# EAGLE design Ctrl_main10 (EAGLE 9.1.3)
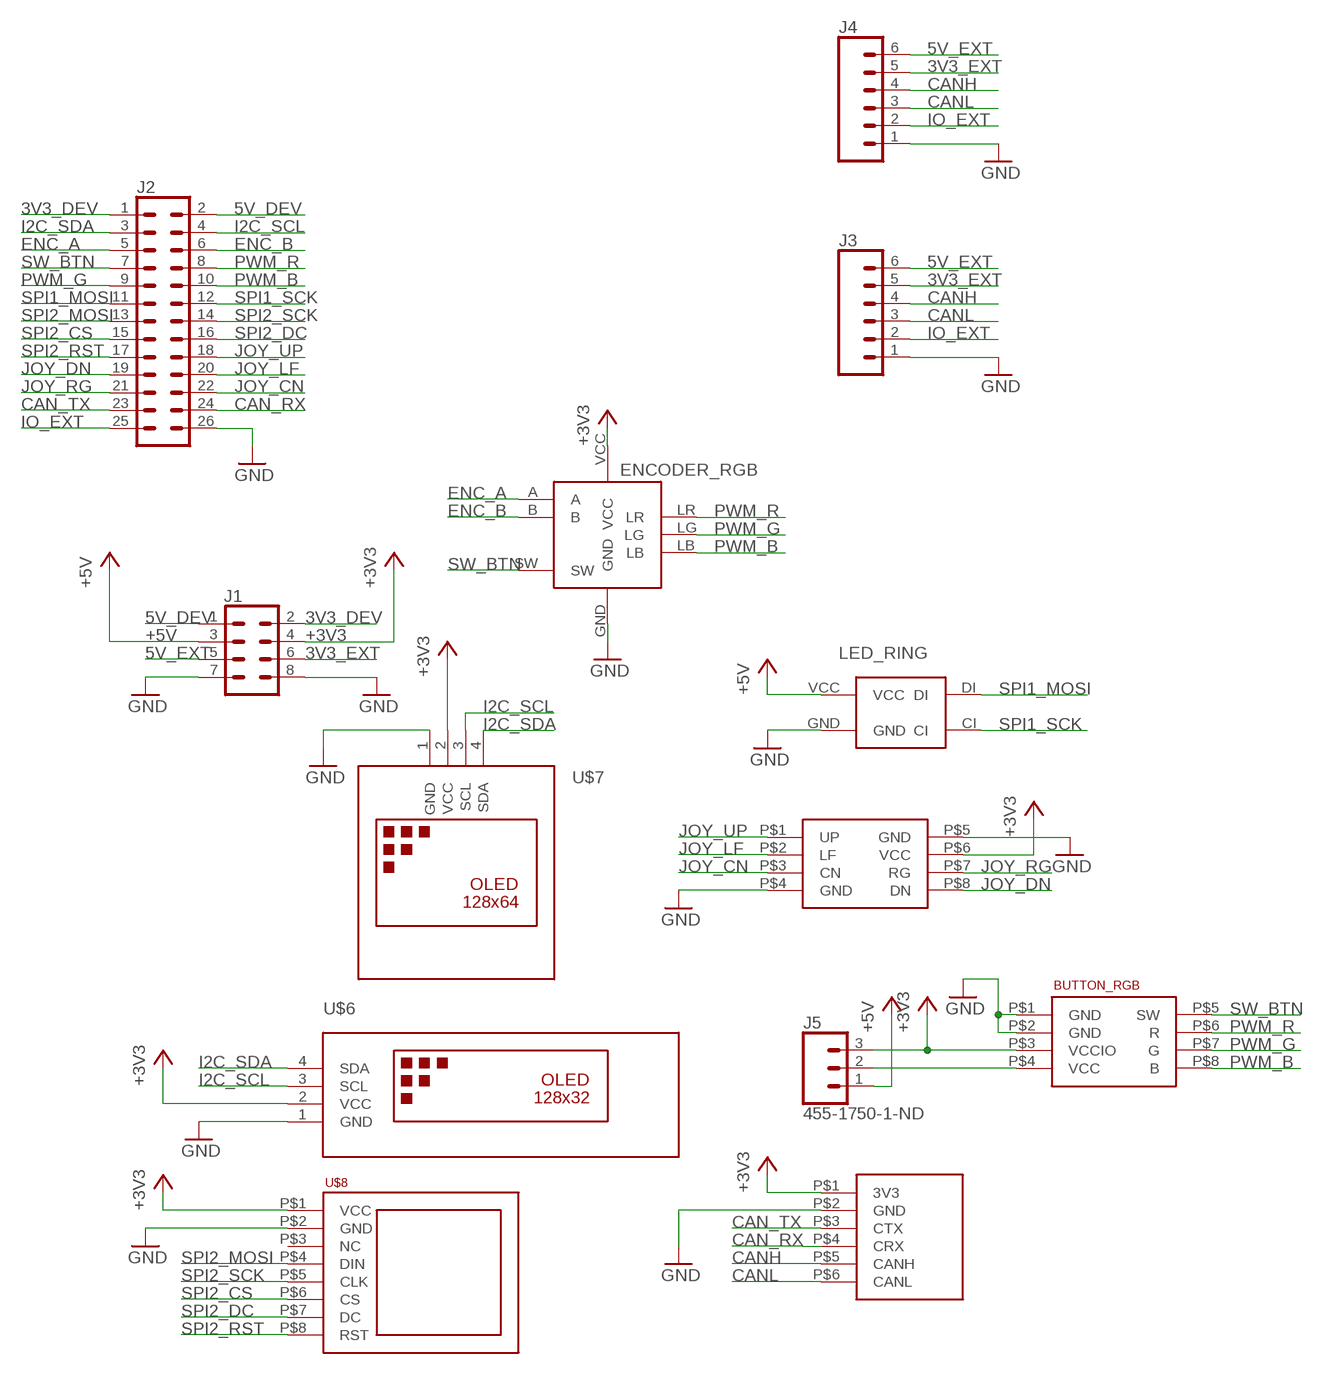
[diagram p0: schematic, sheet 1]

## Parts
BUTTON_RGB  CTRL_BTNRGB_BRD  [CTRL_BTNRGB_BRD]
ENCODER_RGB  CTRL_ENC  [CTRL_ENC]
J1  CONN_04X2  [2X4]
J2  CONN_13X22X13  [2X13]
J3  CONN_06SILK_FEMALE_PTH  [1X06]
J4  CONN_06SILK_FEMALE_PTH  [1X06]
J5  455-1750-1-ND  CONN_03  [1X03]
LED_RING  CTRL_RING  [CTRL_RING]
U$3  CTRL_JOY  [CTRL_JOY]
U$4  CTRL_CAN  [CTRL_CAN]
U$6  DISPLAY-OLED-128X32  [DISPLAY-OLED-128X32]
U$7  DISPLAY-OLED-128X64-I2C  [DISPLAY-OLED-128X64-I2C]
U$8  OLED_WS128  [OLED_WS128]

## Nets
3V3_DEV: J1.2 J2.1
3V3_EXT: J1.6 J3.5 J4.5
5V_DEV: J1.1 J2.2
5V_EXT: J1.5 J3.6 J4.6
+3V3: BUTTON_RGB.P$3(VCCIO) ENCODER_RGB.VCC J1.4 J5.3 U$3.P$6(VCC) U$4.P$1(3V3) U$6.2(VCC) U$7.2(VCC) U$8.P$1(VCC)
+5V: J1.3 J5.1 LED_RING.VCC
CAN_RX: J2.24 U$4.P$4(CRX)
CAN_TX: J2.23 U$4.P$3(CTX)
CANH: J3.4 J4.4 U$4.P$5(CANH)
CANL: J3.3 J4.3 U$4.P$6(CANL)
ENC_A: ENCODER_RGB.A J2.5
ENC_B: ENCODER_RGB.B J2.6
GND: BUTTON_RGB.P$1(GND) BUTTON_RGB.P$2(GND) ENCODER_RGB.GND J1.7 J1.8 J2.26 J3.1 J4.1 LED_RING.GND U$3.P$4(GND) U$3.P$5(GND) U$4.P$2(GND) U$6.1(GND) U$7.1(GND) U$8.P$2(GND)
I2C_SCL: J2.4 U$6.3(SCL) U$7.3(SCL)
I2C_SDA: J2.3 U$6.4(SDA) U$7.4(SDA)
IO_EXT: J2.25 J3.2 J4.2
JOY_CN: J2.22 U$3.P$3(CN)
JOY_DN: J2.19 U$3.P$8(DN)
JOY_LF: J2.20 U$3.P$2(LF)
JOY_RG: J2.21 U$3.P$7(RG)
JOY_UP: J2.18 U$3.P$1(UP)
N$1: BUTTON_RGB.P$4(VCC) J5.2
PWM_B: BUTTON_RGB.P$8(B) ENCODER_RGB.LB J2.10
PWM_G: BUTTON_RGB.P$7(G) ENCODER_RGB.LG J2.9
PWM_R: BUTTON_RGB.P$6(R) ENCODER_RGB.LR J2.8
SPI1_MOSI: J2.11 LED_RING.DI
SPI1_SCK: J2.12 LED_RING.CI
SPI2_CS: J2.15 U$8.P$6(CS)
SPI2_DC: J2.16 U$8.P$7(DC)
SPI2_MOSI: J2.13 U$8.P$4(DIN)
SPI2_RST: J2.17 U$8.P$8(RST)
SPI2_SCK: J2.14 U$8.P$5(CLK)
SW_BTN: BUTTON_RGB.P$5(SW) ENCODER_RGB.SW J2.7
Unconnected: U$8.P$3(NC)

## Library data of the parts
BUTTON_RGB = Ctrl:CTRL_BTNRGB_BRD
ENCODER_RGB = Ctrl:CTRL_ENC
J1 = SparkFun-Connectors:CONN_04X2: Multi connection point. Often used as Generic Header-pin footprint for 0.1 inch spaced/style header connections On any of the 0.1 inch spaced packages, you can populate with these: Break Away Headers - Straight <https://www.sparkfun.com/products/116> (PRT-00116) Break Away Male Headers - Right Angle <https://www.sparkfun.com/products/553> (PRT-00553) Female Headers <https://www.sparkfun.com/products/115> (PRT-00115) Break Away Headers - Machine Pin <https://www.sparkfun.com/products/117> (PRT-00117) Break Away Female Headers - Swiss Machine Pin <https://www.sparkfun.com/products/743> (PRT-00743)
J2 = Ctrl:CONN_13X2: Multi connection point. Often used as Generic Header-pin footprint for 0.1 inch spaced/style header connections On any of the 0.1 inch spaced packages, you can populate with these: Break Away Headers - Straight <https://www.sparkfun.com/products/116> (PRT-00116) Break Away Male Headers - Right Angle <https://www.sparkfun.com/products/553> (PRT-00553) Female Headers <https://www.sparkfun.com/products/115> (PRT-00115) Break Away Headers - Machine Pin <https://www.sparkfun.com/products/117> (PRT-00117) Break Away Female Headers - Swiss Machine Pin <https://www.sparkfun.com/products/743> (PRT-00743)
J3 J4 = SparkFun-Connectors:CONN_06: Multi connection point. Often used as Generic Header-pin footprint for 0.1 inch spaced/style header connections On any of the 0.1 inch spaced packages, you can populate with these: Break Away Headers - Straight <https://www.sparkfun.com/products/116> (PRT-00116) Break Away Male Headers - Right Angle <https://www.sparkfun.com/products/553> (PRT-00553) Female Headers <https://www.sparkfun.com/products/115> (PRT-00115) Break Away Headers - Machine Pin <https://www.sparkfun.com/products/117> (PRT-00117) Break Away Female Headers - Swiss Machine Pin <https://www.sparkfun.com/products/743> (PRT-00743) Arduino Stackable Header - 6 Pin <https://www.sparkfun.com/products/9280> (PRT-09280) For SCREWTERMINALS and SPRING TERMINALS visit here: Screw Terimnals on SparkFun.com <https://www.sparkfun.com/search/results?term=Screw+Terminals> (5mm/3.5mm/2.54mm spacing) This device is also useful as a general connection point to wire up your design to another part of your project. Our various solder wires solder well into these plated through hole pads. Hook-Up Wire - Assortment (Stranded, 22 AWG) <https://www.sparkfun.com/products/11375> (PRT-11375) Hook-Up Wire - Assortment (Solid Core, 22 AWG) <https://www.sparkfun.com/products/11367> (PRT-11367) View the entire wire category on our website here <https://www.sparkfun.com/categories/141>; PROD_ID: CONN-08437
J5 = SparkFun-Connectors:CONN_03: Multi connection point. Often used as Generic Header-pin footprint for 0.1 inch spaced/style header connections On any of the 0.1 inch spaced packages, you can populate with these: Break Away Headers - Straight <https://www.sparkfun.com/products/116> (PRT-00116) Break Away Male Headers - Right Angle <https://www.sparkfun.com/products/553> (PRT-00553) Female Headers <https://www.sparkfun.com/products/115> (PRT-00115) Break Away Headers - Machine Pin <https://www.sparkfun.com/products/117> (PRT-00117) Break Away Female Headers - Swiss Machine Pin <https://www.sparkfun.com/products/743> (PRT-00743) Stackable Header - 3 Pin (Female, 0.1") <https://www.sparkfun.com/products/13875> (PRT-13875) For SCREWTERMINALS and SPRING TERMINALS visit here: Screw Terimnals on SparkFun.com <https://www.sparkfun.com/search/results?term=Screw+Terminals> (5mm/3.5mm/2.54mm spacing) This device is also useful as a general connection point to wire up your design to another part of your project. Our various solder wires solder well into these plated through hole pads. Hook-Up Wire - Assortment (Stranded, 22 AWG) <https://www.sparkfun.com/products/11375> (PRT-11375) Hook-Up Wire - Assortment (Solid Core, 22 AWG) <https://www.sparkfun.com/products/11367> (PRT-11367) View the entire wire category on our website here <https://www.sparkfun.com/categories/141> Special notes: Molex polarized connector foot print use with SKU : PRT-08232 with associated crimp pins and housings.; PROD_ID: XXX-00000
LED_RING = Ctrl:CTRL_RING
U$3 = Ctrl:CTRL_JOY
U$4 = Ctrl:CTRL_CAN
U$6 = diy-modules:DISPLAY-OLED-128X32: 128x32 Dot Matrix OLED Module with I2C interface based on SSD1306 chip More details available here: http://www.tinyosshop.com/index.php?route=product/product&product_id=953 Schematic available here: http://www.tinyosshop.com/datasheet/OLED%2012832.pdf SSD1306 datasheet: https://cdn-shop.adafruit.com/datasheets/SSD1306.pdf Click here to find device on ebay.com <http://www.ebay.com/sch/oled+display+128x32+i2c>
U$7 = diy-modules:DISPLAY-OLED-128X64-I2C: 128x64 Dot Matrix OLED Module based on SSD1306 chip Variant with I2C interface More details available here: http://www.instructables.com/id/Monochrome-096-i2c-OLED-display-with-arduino-SSD13/ SSD1306 datasheet: https://cdn-shop.adafruit.com/datasheets/SSD1306.pdf Click here to find device on ebay.com <http://www.ebay.com/sch/oled+display+128x64+iic> Note: There are two variants: I2C and SPI. Search for the proper version.
U$8 = Ctrl:OLED_WS128

## Board
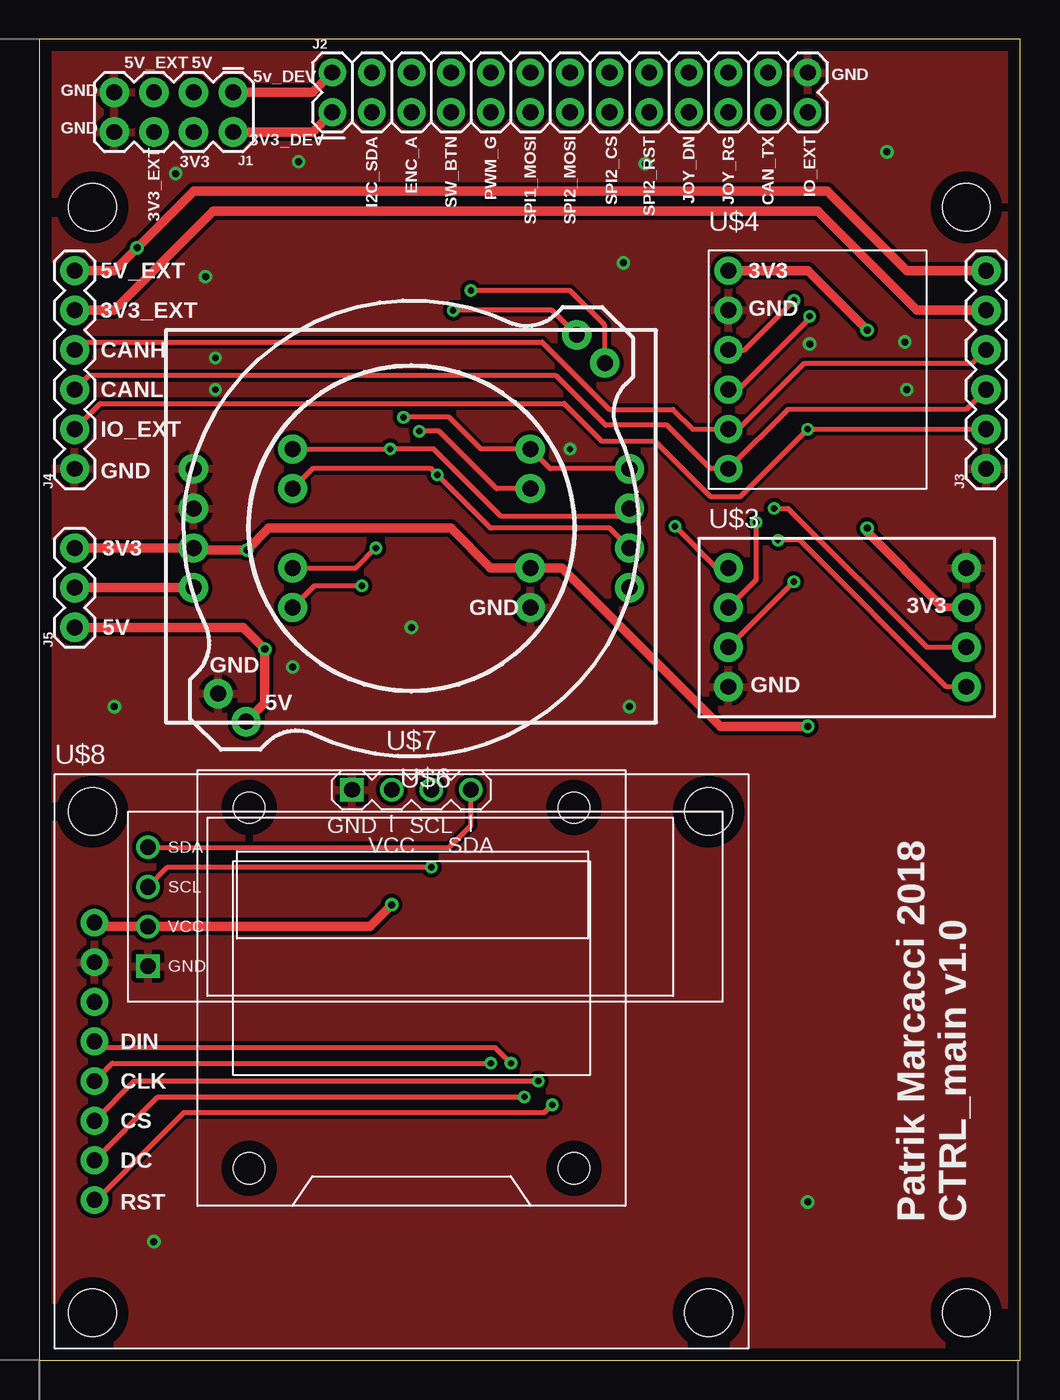
[diagram p1: board, top side]
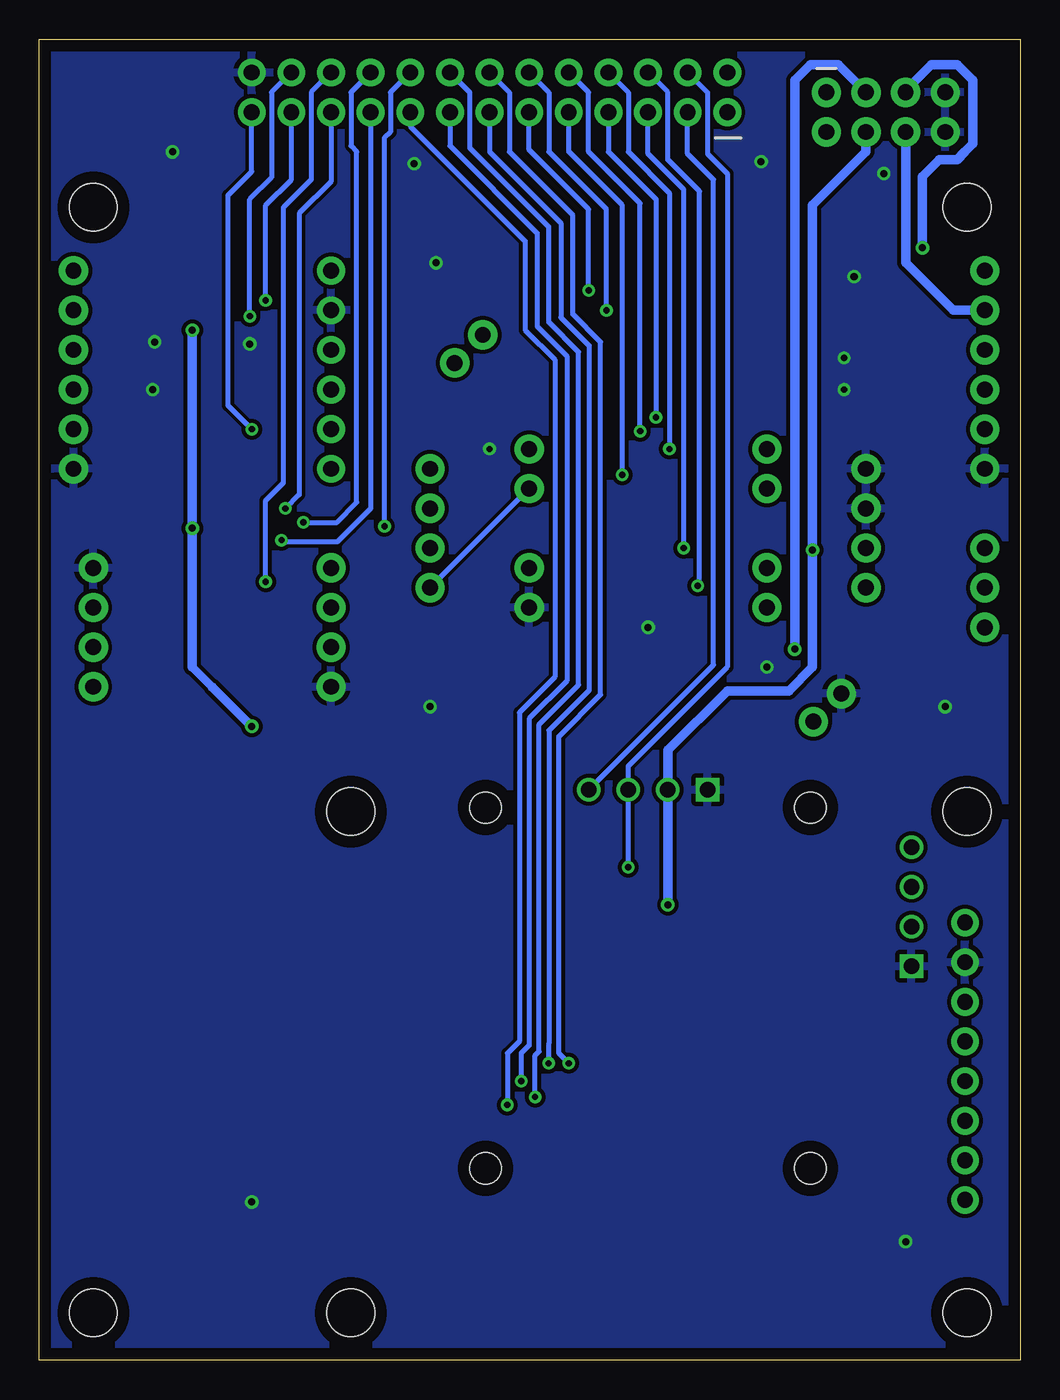
[diagram p2: board, bottom side, seen from below]

Size 62.92 x 84.7 mm. Coordinates in mm from the lower left corner, seen from the top.
Outline: 0,0 62.92,0 62.92,84.7 0,84.7 0,0
Copper layers (1*16): Top 0.035mm / dielectric 1.5mm / Bottom 0.035mm
Design rules "default *": minimum track width 6mil, minimum drill 0.35mm, track to track 10mil, track to pad 10mil, pad to pad 10mil, via to via 10mil, smd to smd 10mil, copper to edge 30mil, drill to drill 6mil, minimum pad ring 10mil, minimum via ring 8mil, stop-mask expansion 4mil, vias tented up to drill 18mil, thermal gap 12mil
Holes 3.05 mm at 59.44,3.05 59.44,73.91 3.43,73.91

### Footprints (pad centres in the part's own frame; a part is rotated, then mirrored left to right if it is on the bottom)
CTRL_BTNRGB_BRD = drill 1.016 pad 1.88: P$1 -13.97,3.81; P$2 -13.97,1.27; P$3 -13.97,-1.27; P$4 -13.97,-3.81; P$5 13.97,3.81; P$6 13.97,1.27; P$7 13.97,-1.27; P$8 13.97,-3.81
CTRL_ENC = drill 1.016 pad 1.88: A -7.62,-2.54; B -7.62,-5.08; GND 7.62,-5.08; LB 7.62,2.54; LG -7.62,2.54; LR -7.62,5.08; SW 7.62,5.08; VCC 7.62,-2.54
2X4 = drill 1.016 pad 1.88: 1 -3.81,-1.27; 2 -3.81,1.27; 3 -1.27,-1.27; 4 -1.27,1.27; 5 1.27,-1.27; 6 1.27,1.27; 7 3.81,-1.27; 8 3.81,1.27
2X13 = drill 1.016 pad 1.778: 1 0,0; 2 0,2.54; 3 2.54,0; 4 2.54,2.54; 5 5.08,0; 6 5.08,2.54; 7 7.62,0; 8 7.62,2.54; 9 10.16,0; 10 10.16,2.54; 11 12.7,0; 12 12.7,2.54; 13 15.24,0; 14 15.24,2.54; 15 17.78,0; 16 17.78,2.54; 17 20.32,0; 18 20.32,2.54; 19 22.86,0; 20 22.86,2.54; 21 25.4,0; 22 25.4,2.54; 23 27.94,0; 24 27.94,2.54; 25 30.48,0; 26 30.48,2.54
1X06 = drill 1.016 pad 1.88: 1 0,0; 2 2.54,0; 3 5.08,0; 4 7.62,0; 5 10.16,0; 6 12.7,0
1X03 = drill 1.016 pad 1.88: 1 0,0; 2 2.54,0; 3 5.08,0
CTRL_RING = drill 1.016 pad 1.88: CI 1.27,-16.256; DI -1.27,-16.256; GND 1.27,16.256; VCC -1.27,16.256
CTRL_JOY = drill 1.016 pad 1.88: P$1 -7.62,3.81; P$2 -7.62,1.27; P$3 -7.62,-1.27; P$4 -7.62,-3.81; P$5 7.62,3.81; P$6 7.62,1.27; P$7 7.62,-1.27; P$8 7.62,-3.81
CTRL_CAN = drill 1.016 pad 1.778: P$1 -3.81,6.35; P$2 -3.81,3.81; P$3 -3.81,1.27; P$4 -3.81,-1.27; P$5 -3.81,-3.81; P$6 -3.81,-6.35
DISPLAY-OLED-128X32 = drill 1 square: 1 -17.78,-3.81 | drill 1: 2 -17.78,-1.27; 3 -17.78,1.27; 4 -17.78,3.81
DISPLAY-OLED-128X64-I2C = drill 1 square: 1 -3.81,12.7 | drill 1: 2 -1.27,12.7; 3 1.27,12.7; 4 3.81,12.7 | hole 2: -10.414,11.557; 10.414,11.557; 10.414,-11.557; -10.414,-11.557
OLED_WS128 = drill 1.016 pad 1.778: P$1 2.54,-10.16; P$2 2.54,-12.7; P$3 2.54,-15.24; P$4 2.54,-17.78; P$5 2.54,-20.32; P$6 2.54,-22.86; P$7 2.54,-25.4; P$8 2.54,-27.94 | hole 3.048: 2.413,-3.048; 41.91,-3.048; 41.91,-35.179; 2.413,-35.179

### Placement (x,y rotation side)
BUTTON_RGB  23.88,53.34 0 top
ENCODER_RGB  23.88,53.34 0 top
J1  8.64,80.01 180 top
J2  18.8,80.01 0 top
J3  60.71,57.15 90 top
J4  2.29,57.15 90 top
J5  2.29,46.99 90 top
LED_RING  23.88,53.34 135 top
U$3  51.82,46.99 0 top
U$4  48.01,63.5 0 top
U$6  24.76,29.08 0 top
U$7  23.88,23.88 0 top
U$8  1.02,38.23 0 top

### Tracks (layer width: path | path; a pad name or v marks a point on that pad's centre or on a via)
3V3_DEV
  Top 0.61: J1.2 17.53,78.74 J2.1
3V3_EXT
  Top 0.61: J4.5 4.83,67.31 11.18,73.66 49.91,73.66 56.26,67.31 J3.5
  Bottom 0.61: J4.5 4.32,67.31 7.37,70.36 J1.6
5V_DEV
  Top 0.61: J1.1 17.53,81.28 J2.2
5V_EXT  (via drill 0.45)
  Top 0.61: J3.6 55.63,69.85 50.55,74.93 9.91,74.93 v6.29,71.31 4.83,69.85 J4.6
  Bottom 0.508: J1.5 7.37,81.41
  Bottom 0.61: 7.37,81.41 5.71,83.06 4.06,83.06 3.05,82.04 3.05,79.38 3.05,77.98 3.56,77.47 4.06,76.96 5.21,76.96 6.29,75.88 v6.29,71.31
+3V3  (via drill 0.45)
  Top 0.508: U$3.P$6 57.91,48.26 | 53.09,53.09 v53.09,53.34 | 10.03,51.94 BUTTON_RGB.P$3 | U$8.P$1 3.81,27.81
  Top 0.61: J5.3 BUTTON_RGB.P$3 | 10.03,51.94 11.56,51.94 v13.34,51.94 14.73,53.34 26.42,53.34 28.96,50.8 ENCODER_RGB.VCC 33.53,50.8 43.69,40.64 v49.28,40.64 | v53.09,66.04 49.28,69.85 U$4.P$1 | 57.91,48.26 53.09,53.09 | 3.81,27.81 U$6.2 21.21,27.81 v22.61,29.21
  Bottom 0.508: 53.09,44.45 51.82,43.18
  Bottom 0.61: v22.61,29.21 U$7.2 22.61,39.12 18.8,42.93 14.86,42.93 13.34,44.45 v13.34,51.94 13.34,53.98 13.34,74.04 9.91,77.47 J1.4 | v53.09,66.04 v53.09,53.34 53.09,44.45 | 51.82,43.18 v49.28,40.64
+5V  (via drill 0.45)
  Top 0.61: J5.1 13.08,46.99 v14.48,45.59 14.48,42.15 LED_RING.VCC
  Bottom 0.61: v14.48,45.59 14.48,82.04 13.46,83.06 11.68,83.06 J1.3
CAN_RX  (via drill 0.4)
  Top 0.305: U$4.P$4 44.83,62.23 49.47,66.87 v49.4,66.93
  Bottom 0.305: v49.4,66.93 49.4,74.42 48.01,75.82 48.01,81.28 J2.24
CAN_TX  (via drill 0.4)
  Top 0.305: v48.39,67.94 45.21,64.77 U$4.P$3
  Bottom 0.305: v48.39,67.94 48.39,74.04 46.74,75.69 J2.23
CANH
  Top 0.305: J3.4 59.82,63.88 49.02,63.88 44.83,59.69 U$4.P$5 41.91,59.69 40.64,60.96 36.58,60.96 32.26,65.28 2.79,65.28 J4.4
CANL
  Top 0.305: J4.3 3.18,63.12 33.15,63.12 36.32,59.94 40.26,59.94 43.05,57.15 U$4.P$6 48.01,60.96 59.44,60.96 J3.3
ENC_A  (via drill 0.4)
  Top 0.305: ENCODER_RGB.A 20.32,50.8 v21.59,52.07
  Bottom 0.305: v21.59,52.07 21.59,75.06 23.88,77.34 J2.5
ENC_B  (via drill 0.4)
  Top 0.305: ENCODER_RGB.B 17.65,49.66 v20.7,49.66
  Bottom 0.305: v20.7,49.66 20.57,49.78 20.57,74.93 22.61,76.96 22.61,81.28 J2.6
GND  (via drill 0.4, 0.45)
  other vias: 11.3,64.26 11.3,62.23 34.04,58.42 55.63,62.23 7.37,7.62 49.28,10.16 4.83,41.91 23.88,46.99 49.4,65.15 55.5,65.28 54.36,77.47 8.76,76.07 16.26,44.45 16.64,76.83 38.86,76.71 37.85,41.91 37.47,70.36 10.67,69.47
  pour Bottom: -0.25,85.09 -0.25,0 63.25,0 63.25,85.09
  pour Top: -0.25,85.09 -0.25,0 63.25,0 63.25,85.09
I2C_SCL  (via drill 0.4)
  Top 0.305: v25.15,31.62 8.25,31.62 U$6.3
  Bottom 0.305: v25.15,31.62 U$7.3 25.15,38.1 18.8,44.45 18.8,76.07 20.07,77.34 20.07,81.28 J2.4
I2C_SDA
  Top 0.305: U$6.4 26.29,32.89 27.69,34.29 U$7.4
  Bottom 0.305: U$7.4 19.68,44.58 19.68,75.69 21.34,77.34 J2.3
IO_EXT  (via drill 0.4)
  Top 0.305: J4.2 3.94,61.34 33.66,61.34 36.07,58.93 39.5,58.93 43.05,55.37 44.96,55.37 v49.28,59.69 J3.2
  Bottom 0.305: v49.28,59.69 50.8,61.21 50.8,74.68 49.28,76.2 J2.25
JOY_CN  (via drill 0.4)
  Top 0.305: U$3.P$3 v48.39,49.91
  Bottom 0.305: v48.39,49.91 48.39,55.12 47.24,56.26 47.24,73.91 45.47,75.69 45.47,81.28 J2.22
JOY_DN  (via drill 0.4)
  Top 0.305: U$3.P$8 58.17,43.18 48.77,52.58 v47.37,52.58
  Bottom 0.305: J2.19 41.66,77.85 41.66,54.61 42.93,53.34 43.79,52.48 47.27,52.48 v47.37,52.58
JOY_LF  (via drill 0.4)
  Top 0.305: U$3.P$2 45.97,50.04 v45.97,53.72
  Bottom 0.305: v45.97,53.72 43.81,53.72 42.55,54.99 42.55,77.47 42.93,77.85 42.93,81.28 J2.20
JOY_RG  (via drill 0.4)
  Top 0.305: v47.12,54.61 48.01,54.61 56.9,45.72 U$3.P$7
  Bottom 0.305: J2.21 44.2,75.56 46.23,73.53 46.23,55.5 v47.12,54.61
JOY_UP  (via drill 0.4)
  Top 0.305: v40.77,53.47 43.43,50.8 U$3.P$1
  Bottom 0.305: v40.77,53.47 40.77,78.36 40.39,78.74 40.39,81.28 J2.18
N$1
  Top 0.61: J5.2 BUTTON_RGB.P$4
PWM_B  (via drill 0.4)
  Top 0.305: v24.38,59.56 25.65,59.56 29.34,55.88 ENCODER_RGB.LB
  Bottom 0.305: BUTTON_RGB.P$8 ENCODER_RGB.LB | v24.38,59.56 24.38,74.17 27.69,77.47 27.69,81.28 J2.10
PWM_G  (via drill 0.4)
  Top 0.305: BUTTON_RGB.P$7 36.58,53.34 28.96,53.34 v25.53,56.77 25.15,57.15 17.53,57.15 ENCODER_RGB.LG
  Bottom 0.305: J2.9 28.96,77.47 25.53,74.04 v25.53,56.77
PWM_R  (via drill 0.4)
  Top 0.305: BUTTON_RGB.P$6 37.34,54.1 29.62,54.1 25.3,58.42 v22.51,58.42 ENCODER_RGB.LR
  Bottom 0.305: J2.8 25.15,81.28 25.15,77.47 22.51,74.83 v22.51,58.42
SPI1_MOSI  (via drill 0.4)
  Top 0.305: LED_RING.DI 36.27,66.35 34.04,68.58 v27.69,68.58
  Bottom 0.305: v27.69,68.58 27.69,73.79 31.5,77.6 J2.11
SPI1_SCK  (via drill 0.4)
  Top 0.305: LED_RING.CI 32.89,67.31 v26.54,67.31
  Bottom 0.305: v26.54,67.31 26.54,73.79 30.23,77.47 30.23,81.28 J2.12
SPI2_CS  (via drill 0.4)
  Top 0.305: v32,17.91 6.1,17.91 U$8.P$6
  Bottom 0.305: J2.15 36.58,77.85 30.99,72.26 30.99,66.29 29.08,64.39 29.08,43.56 31.5,41.15 31.5,20.19 32,19.68 v32,17.91
SPI2_DC  (via drill 0.4)
  Top 0.305: v31.11,16.89 7.62,16.89 U$8.P$7
  Bottom 0.305: v31.11,16.89 31.11,19.56 30.86,19.81 30.86,40.77 28.32,43.31 28.32,64.64 30.23,66.55 30.23,72.64 35.31,77.72 35.31,81.28 J2.16
SPI2_MOSI  (via drill 0.4)
  Top 0.305: U$8.P$4 3.94,20.07 29.24,20.07 v30.25,19.05
  Bottom 0.305: J2.13 34.04,77.47 29.46,72.9 29.46,66.86 27.66,65.05 27.66,42.95 30.23,40.39 30.23,20.32 30.23,19.08 v30.25,19.05
SPI2_RST  (via drill 0.4)
  Top 0.305: U$8.P$8 3.68,10.29 9.27,15.88 32.39,15.88 v32.89,16.38
  Bottom 0.305: J2.17 39.12,79.12 31.75,71.75 31.75,66.04 29.85,64.14 29.85,43.82 32.13,41.53 32.13,20.45 32.89,19.68 v32.89,16.38 | v32.89,16.38 32.89,16.26 v32.89,16.38
SPI2_SCK  (via drill 0.4)
  Top 0.305: v28.96,19.05 4.7,19.05 U$8.P$5
  Bottom 0.305: v28.96,19.05 29.59,19.68 29.59,40.01 26.92,42.67 26.92,65.28 28.7,67.06 28.7,73.41 32.77,77.47 32.77,81.28 J2.14
SW_BTN  (via drill 0.4)
  Top 0.305: BUTTON_RGB.P$5 32.77,57.15 ENCODER_RGB.SW 28.32,58.42 26.29,60.45 v23.37,60.45
  Bottom 0.305: J2.7 26.42,77.47 23.37,74.42 v23.37,60.45

### Text on the board
tPlace: 5V_EXT | 5V | 5v_DEV | GND | GND | GND | 3V3_DEV | I2C_SDA | ENC_A | SW_BTN | PWM_G | SPI1_MOSI | SPI2_MOSI | SPI2_CS | SPI2_RST | JOY_DN | JOY_RG | CAN_TX | IO_EXT | 3V3 | 3V3_EXT | 5V_EXT | 3V3 | 3V3_EXT | GND | CANH | CANL | IO_EXT | GND | 3V3 | 3V3 | GND | 5V | GND | GND | 5V | DIN | CLK | CS | DC | RST | Patrik Marcacci 2018 / CTRL_main v1.0